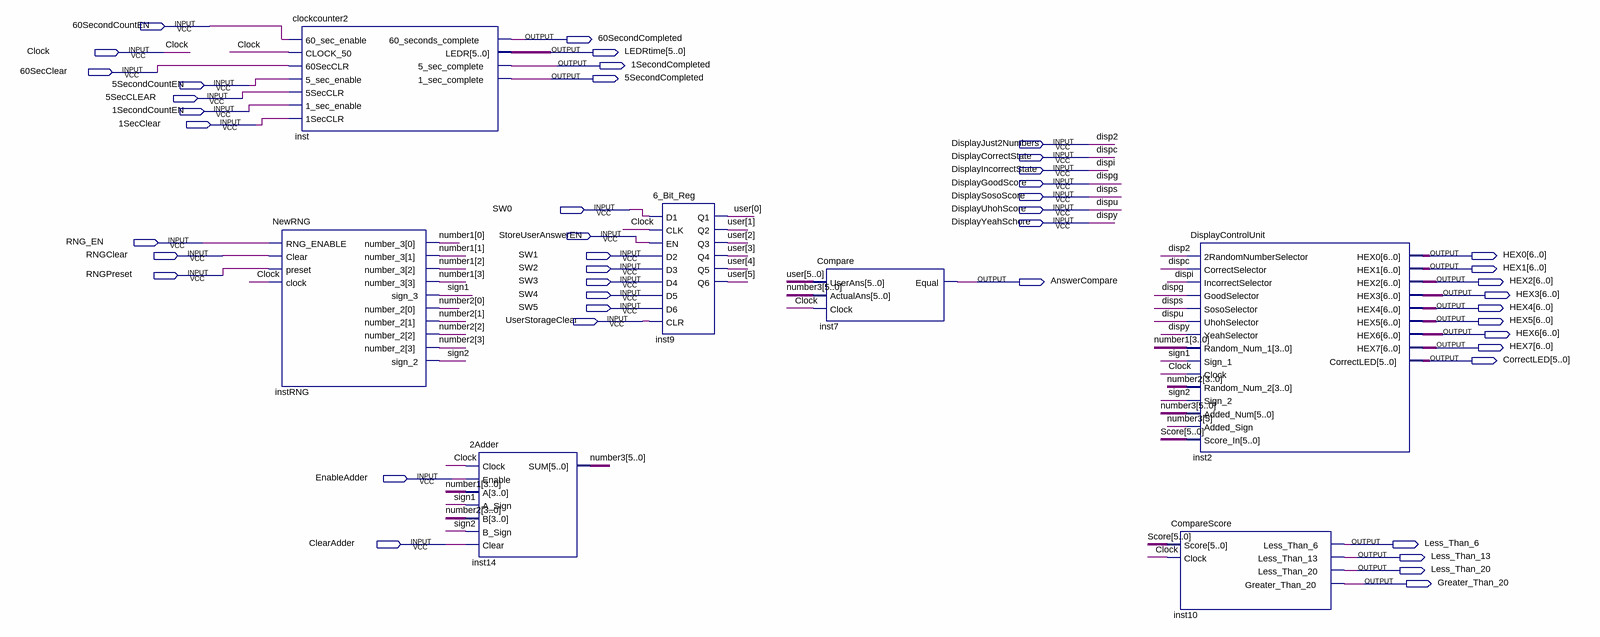
[diagram p0: schematic sheet]
// Quartus schematic datapath1.bdf as structural Verilog: 7 symbols, 45 pins
module datapath1 (
  input  \60SecondCountEN ,
  input  Clock,
  input  \60SecClear ,
  input  \5SecondCountEN ,
  input  \5SecCLEAR ,
  input  \1SecondCountEN ,
  input  \1SecClear ,
  input  DisplayJust2Numbers,
  input  DisplayCorrectState,
  input  DisplayIncorrectState,
  input  DisplayGoodScore,
  input  DisplaySosoScore,
  input  SW0,
  input  DisplayUhohScore,
  input  DisplayYeahSchore,
  input  StoreUserAnswerEN,
  input  RNG_EN,
  input  RNGClear,
  input  SW1,
  input  SW2,
  input  RNGPreset,
  input  SW3,
  input  SW4,
  input  SW5,
  input  UserStorageClear,
  input  EnableAdder,
  input  ClearAdder,
  output \60SecondCompleted ,
  output [5:0] LEDRtime,
  output \1SecondCompleted ,
  output \5SecondCompleted ,
  output [6:0] HEX0,
  output [6:0] HEX1,
  output AnswerCompare,
  output [6:0] HEX2,
  output [6:0] HEX3,
  output [6:0] HEX4,
  output [6:0] HEX5,
  output [6:0] HEX6,
  output [6:0] HEX7,
  output [5:0] CorrectLED,
  output Less_Than_6,
  output Less_Than_13,
  output Less_Than_20,
  output Greater_Than_20
);

  wire sign1, sign2;
  wire [3:0] number1, number2;
  wire [5:0] number3, Score, user;

  clockcounter2 inst (
    .\60_sec_enable (\60SecondCountEN ), .CLOCK_50(Clock), .\60SecCLR (\60SecClear ),
    .\5_sec_enable (\5SecondCountEN ), .\5SecCLR (\5SecCLEAR ), .\1_sec_enable (\1SecondCountEN ),
    .\1SecCLR (\1SecClear ), .\60_seconds_complete (\60SecondCompleted ), .LEDR(LEDRtime),
    .\5_sec_complete (\1SecondCompleted ), .\1_sec_complete (\5SecondCompleted ));
  NewRNG instRNG (
    .RNG_ENABLE(RNG_EN), .Clear(RNGClear), .preset(RNGPreset), .clock(Clock), .number_3(number1),
    .sign_3(sign1), .number_2(number2), .sign_2(sign2));
  \2Adder  inst14 (
    .Clock(Clock), .Enable(EnableAdder), .A(number1), .A_Sign(sign1), .B(number2), .B_Sign(sign2),
    .Clear(ClearAdder), .SUM(number3));
  \6_Bit_Reg  inst9 (
    .D1(SW0), .CLK(Clock), .EN(StoreUserAnswerEN), .CLR(UserStorageClear), .Q1(user[0]), .Q2(user[1]),
    .Q3(user[2]), .Q4(user[3]), .Q5(user[4]), .Q6(user[5]));  // open: D2, D3, D4, D5, D6
  Compare inst7 (.UserAns(user), .ActualAns(number3), .Clock(Clock), .Equal(AnswerCompare));
  DisplayControlUnit inst2 (
    .\2RandomNumberSelector (DisplayJust2Numbers), .CorrectSelector(DisplayCorrectState),
    .IncorrectSelector(DisplayIncorrectState), .GoodSelector(DisplayGoodScore),
    .SosoSelector(DisplaySosoScore), .UhohSelector(DisplayUhohScore), .YeahSelector(DisplayYeahSchore),
    .Random_Num_1(number1), .Sign_1(sign1), .Clock(Clock), .Random_Num_2(number2), .Sign_2(sign2),
    .Added_Num(number3), .Added_Sign(number3[5]), .Score_In(Score), .HEX0(HEX0), .HEX1(HEX1), .HEX2(HEX2),
    .HEX3(HEX3), .HEX4(HEX4), .HEX5(HEX5), .HEX6(HEX6), .HEX7(HEX7), .CorrectLED(CorrectLED));
  CompareScore inst10 (
    .Score(Score), .Clock(Clock), .Less_Than_6(Less_Than_6), .Less_Than_13(Less_Than_13),
    .Less_Than_20(Less_Than_20), .Greater_Than_20(Greater_Than_20));

  // Other names for the same wires on the sheet: disp2 = DisplayJust2Numbers; dispc = DisplayCorrectState;
  //   dispg = DisplayGoodScore; dispi = DisplayIncorrectState; disps = DisplaySosoScore; dispu = DisplayUhohScore;
  //   dispy = DisplayYeahSchore
endmodule
